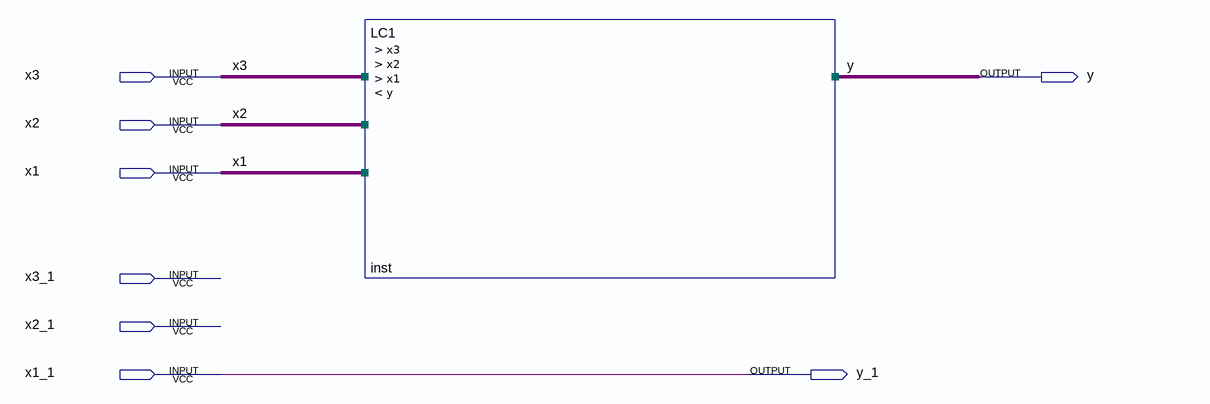
[diagram p0: schematic sheet]
// Quartus schematic CL_Project_Sorokin_Lab1.bdf as structural Verilog: 1 symbols, 8 pins
module CL_Project_Sorokin_Lab1 (
  input  x3,
  input  x2,
  input  x1,
  input  x3_1,
  input  x2_1,
  input  x1_1,
  output y,
  output y_1
);

  LC1 inst (.x3(x3), .x2(x2), .x1(x1), .y(y));

  assign y_1 = x1_1;
endmodule
